# Altium project LineFollowRobot.PrjPcb
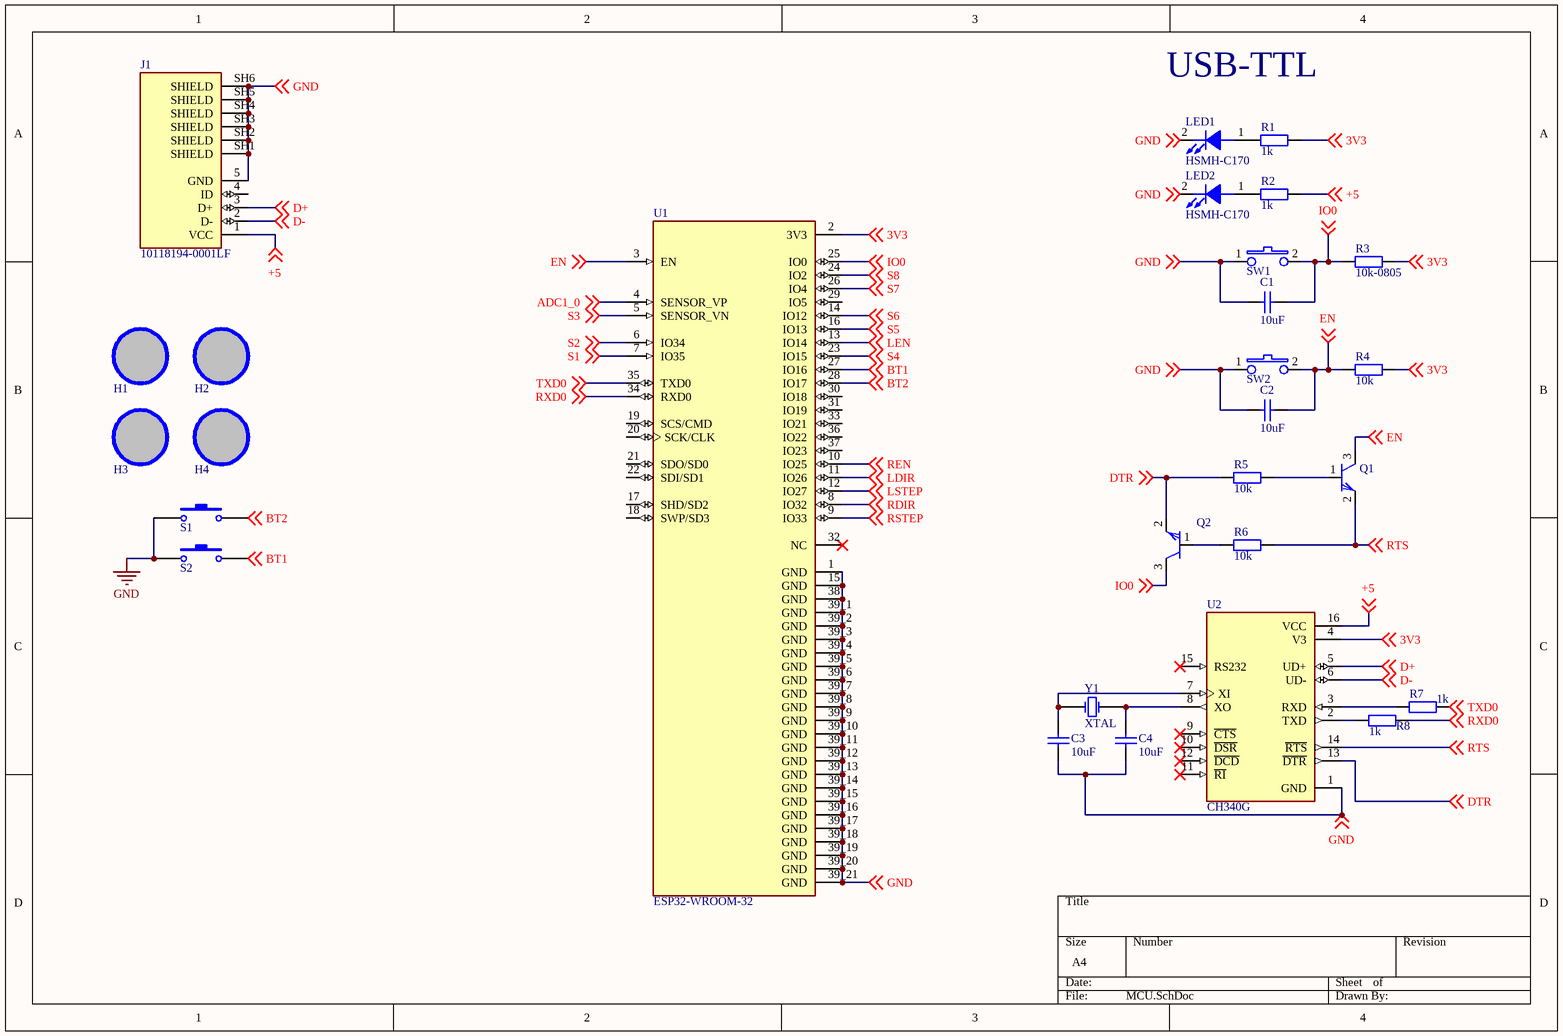
[diagram p0: MCU.SchDoc]
4 sheets, 66 parts. Net scope: global (net labels, ports and power ports of the same name join across sheets).
Board file: PCB1.PcbDoc
Sheets:
  MCU.SchDoc
  Stepper.SchDoc
  Sensor.SchDoc
  ECU supply.SchDoc

## Sheet MCU.SchDoc
size A4; SheetNumber: 1; SheetTotal: 4

### Parts
(Parts that share a designator on the sheet are numbered #1, #2 ... from top to bottom, then left to right.)
C1#1  value 10uF  [C-NP-0805]  (hidden comment: Cap Non-pol)
C2#1  value 10uF  [C-NP-0805]  (hidden comment: Cap Non-pol)
C3#1  value 10uF  [C-NP-0805]  (hidden comment: Cap Non-pol)
C4#1  value 10uF  [C-NP-0805]  (hidden comment: Cap Non-pol)
H1  Hole  [LO KHOAN 3MM]  (value not drawn)
H2  Hole  [LO KHOAN 3MM]  (value not drawn)
H3  Hole  [LO KHOAN 3MM]  (value not drawn)
H4  Hole  [LO KHOAN 3MM]  (value not drawn)
J1#1  10118194-0001LF  [AMPHENOL_10118194-0001LF]
LED1  HSMH-C170  [LED.SMD.RED]
LED2  HSMH-C170  [LED.SMD.RED]
Q1  C1815  [SOT23N]  (value not drawn)
Q2  C1815  [SOT23N]  (value not drawn)
R1#1  value 1k  [DIEN TRO 0805]  (hidden comment: RES_SMD_0805)
R2#1  value 1k  [DIEN TRO 0805]  (hidden comment: RES_SMD_0805)
R3#1  value 10k-0805  [DIEN TRO 0805]  (hidden comment: RES_SMD_0805)
R4#1  value 10k  [DIEN TRO 0805]  (hidden comment: RES_SMD_0805)
R5  value 10k  [DIEN TRO 0805]  (hidden comment: RES_SMD_0805)
R6  value 10k  [DIEN TRO 0805]  (hidden comment: RES_SMD_0805)
R7  value 1k  [DIEN TRO 0805]  (hidden comment: RES_SMD_0805)
R8  value 1k  [DIEN TRO 0805]  (hidden comment: RES_SMD_0805)
S1  Tact SW - 2Pin  [SW2]  (value not drawn)
S2  Tact SW - 2Pin  [SW2]  (value not drawn)
SW1  PTS635  [TactSwitches.PTS635.SMT]  (value not drawn)
SW2  PTS635  [TactSwitches.PTS635.SMT]  (value not drawn)
U1#1  ESP32-WROOM-32  [MODULE_ESP32-WROOM-32]
U2#1  CH340G  [SOIC127P600X180-16N]
Y1  XTAL  [XTAL]

### Nets
3V3: R1#1.2 R3#1.2 R4#1.2 U1#1.2(3V3) U2#1.4(V3) ; off-sheet 3V3
+5: J1#1.1(VCC) R2#1.2 U2#1.16(VCC) ; off-sheet +5
GND: C1#1.1 C2#1.1 C3#1.1 C4#1.1 J1#1.5(GND) J1#1.SH1(SHIELD) J1#1.SH2(SHIELD) J1#1.SH3(SHIELD) J1#1.SH4(SHIELD) J1#1.SH5(SHIELD) J1#1.SH6(SHIELD) LED1.2(K) LED2.2(K) S1.1 S2.1 SW1.1 SW2.1 U1#1.1(GND) U1#1.15(GND) U1#1.38(GND) U1#1.39_1(GND) U1#1.39_2(GND) U1#1.39_3(GND) U1#1.39_4(GND) U1#1.39_5(GND) U1#1.39_6(GND) U1#1.39_7(GND) U1#1.39_8(GND) U1#1.39_9(GND) U1#1.39_10(GND) U1#1.39_11(GND) U1#1.39_12(GND) U1#1.39_13(GND) U1#1.39_14(GND) U1#1.39_15(GND) U1#1.39_16(GND) U1#1.39_17(GND) U1#1.39_18(GND) U1#1.39_19(GND) U1#1.39_20(GND) U1#1.39_21(GND) U2#1.1(GND) ; off-sheet GND
ADC1_0: U1#1.4(SENSOR_VP) ; off-sheet ADC1_0
BT1: S2.2 U1#1.27(IO16) ; off-sheet BT1
BT2: S1.2 U1#1.28(IO17) ; off-sheet BT2
D+: J1#1.3(D+) U2#1.5(UD+) ; off-sheet D+
D-: J1#1.2(D-) U2#1.6(UD-) ; off-sheet D-
DTR: Q2.2(E) R5.1 U2#1.13(~{DTR}) ; off-sheet DTR
EN: C2#1.2 Q1.3(C) R4#1.1 SW2.2 U1#1.3(EN) ; off-sheet EN
IO0: C1#1.2 Q2.3(C) R3#1.1 SW1.2 U1#1.25(IO0) ; off-sheet IO0
LDIR: U1#1.11(IO26) ; off-sheet LDIR
LEN: U1#1.13(IO14) ; off-sheet LEN
LSTEP: U1#1.12(IO27) ; off-sheet LSTEP
RDIR: U1#1.8(IO32) ; off-sheet RDIR
REN: U1#1.10(IO25) ; off-sheet REN
RSTEP: U1#1.9(IO33) ; off-sheet RSTEP
RTS: Q1.2(E) R6.2 U2#1.14(~{RTS}) ; off-sheet RTS
RXD0: R8.2 U1#1.34(RXD0) ; off-sheet RXD0
S1: U1#1.7(IO35) ; off-sheet S1
S2: U1#1.6(IO34) ; off-sheet S2
S3: U1#1.5(SENSOR_VN) ; off-sheet S3
S4: U1#1.23(IO15) ; off-sheet S4
S5: U1#1.16(IO13) ; off-sheet S5
S6: U1#1.14(IO12) ; off-sheet S6
S7: U1#1.26(IO4) ; off-sheet S7
S8: U1#1.24(IO2) ; off-sheet S8
TXD0: R7.2 U1#1.35(TXD0) ; off-sheet TXD0
NetC3#1_2: C3#1.2 U2#1.7(XI) Y1.2(OSC2)
NetC4#1_2: C4#1.2 U2#1.8(XO) Y1.1(OSC1)
NetLED1_1: LED1.1(A) R1#1.1
NetLED2_1: LED2.1(A) R2#1.1
NetQ1_1: Q1.1(B) R5.2
NetQ2_1: Q2.1(B) R6.1
NetR7_1: R7.1 U2#1.3(RXD)
NetR8_1: R8.1 U2#1.2(TXD)

Not connected (* = marked no-connect by the designer): H1 1; H2 1; H3 1; H4 1; J1#1 4(ID); U1#1 17(SHD/SD2) 18(SWP/SD3) 19(SCS/CMD) 20(SCK/CLK) 21(SDO/SD0) 22(SDI/SD1) 29(IO5) 30(IO18) 31(IO19) 32(NC)* 33(IO21) 36(IO22) 37(IO23); U2#1 9(~{CTS})* 10(~{DSR})* 11(~{RI})* 12(~{DCD})* 15(RS232)*

### Notes on the sheet
- USB-TTL

### Library data of the parts
C1#1 C2#1 C3#1 C4#1 = Cap Non-pol: Non-polarized Capacitor; Published: 8-Jun-2000; LatestRevisionDate: 17-Jul-2002; LatestRevisionNote: Re-released for DXP Platform.; PackageReference: RAD-0.3; Publisher: Altium Limited
H1-H4 = Hole: Hole 3mm
J1#1 = 10118194-0001LF: Micro USB, Input Output Connectors, B TYPE RECEPTACLE with flange; MF: Amphenol ICC; SnapEDA_Link: https://www.snapeda.com/parts/10118194-0001LF/Amphenol+FCI/view-part/?ref=snap; Package: None; Value: *; MP: 10118194-0001LF; Check_prices: https://www.snapeda.com/parts/10118194-0001LF/Amphenol+FCI/view-part/?ref=eda
LED1 LED2 = LED_1: Typical GaAs SMD LED; Manufacturer: Lite-On Inc; Color: RED; Type: Cong ty RP; Vendor: Digikey; Publisher: Hoang Nguyen; Price: *; Published: 13-April-2009; ComponentLink1Description: Digikey Part Link; ComponentLink2Description: Open Datasheet; ComponentLink2URL: H:\LIBRARY\LIBRARY.Datasheet\
Q1 Q2 = C1815: Q2SC1815; PSpiceTemplate: Q^@REFDES %c %b %e @MODEL; Vendor: Digikey; COMPONENT: 2SC1815; Published: 13-April-2009; Publisher: Hoang Nguyen; ComponentLink1Description: Digikey Part Link; ComponentLink2Description: Open Datasheet; ComponentLink2URL: H:\LIBRARY\LIBRARY.Datasheet\; Price: 500VND
R1#1 R2#1 R3#1 R4#1 R5-R8 = RES_SMD_0805: RES_0805; Published: 8-Jun-2000; LatestRevisionDate: 17-Jul-2002; LatestRevisionNote: Re-released for DXP Platform.; PackageReference: AXIAL-0.4; Publisher: Altium Limited
S1 S2 = Tact SW - 2Pin: Switch button 2 pin
SW1 SW2 = SW TACT MOM SPST: SWITCH TACT MOM SPST SMD; Manufacturer: C&K Components; Manufacturer P/N: PTS635SL25SMTR LFS; Vendor: Digikey; Vendor P/N: CKN9119CT-ND; ComponentLink1URL: http://search.digikey.com/scripts/DkSearch/dksus.dll?Detail&name=CKN1573CT-ND; ComponentLink2URL: H:\LIBRARY\LIBRARY.Datasheet\SBLCDA4_Specification.pdf; ComponentLink1Description: Digikey Part Link; ComponentLink2Description: Open Datasheet; Publisher: Hoang Nguyen; Published: 13-April-2009
U1#1 = ESP32-WROOM-32: Bluetooth, WiFi 802.11b/g/n, Bluetooth v4.2 +EDR, Class 1, 2 and 3 Transceiver Module 2.4GHz ~ 2.5GHz Antenna Not Included, U.FL Surface Mount; MF: Espressif Systems; Price: None; Availability: In Stock; MP: ESP32-WROOM-32; Package: Module Espressif Systems; SnapEDA_Link: https://www.snapeda.com/parts/ESP32-WROOM-32/Espressif+Systems/view-part/?ref=snap; Check_prices: https://www.snapeda.com/parts/ESP32-WROOM-32/Espressif+Systems/view-part/?ref=eda; Value: *; Purchase-URL: https://pricing.snapeda.com/search/part/ESP32-WROOM-32/?ref=eda
U2#1 = CH340G: USB Interface Integrated Circuit; MF: WCH; Value: *; SnapEDA_Link: https://www.snapeda.com/parts/Ch340G/WCH/view-part/?ref=snap; MP: Ch340G; Check_prices: https://www.snapeda.com/parts/Ch340G/WCH/view-part/?ref=eda; Availability: Not in stock; Price: None; Package: None
Y1 = XTAL: Crystal Oscillator; Published: 8-Jun-2000; LatestRevisionDate: 17-Jul-2002; LatestRevisionNote: Re-released for DXP Platform.; PackageReference: R38; Publisher: Altium Limited

## Sheet Stepper.SchDoc
size A; SheetNumber: 2; SheetTotal: 4
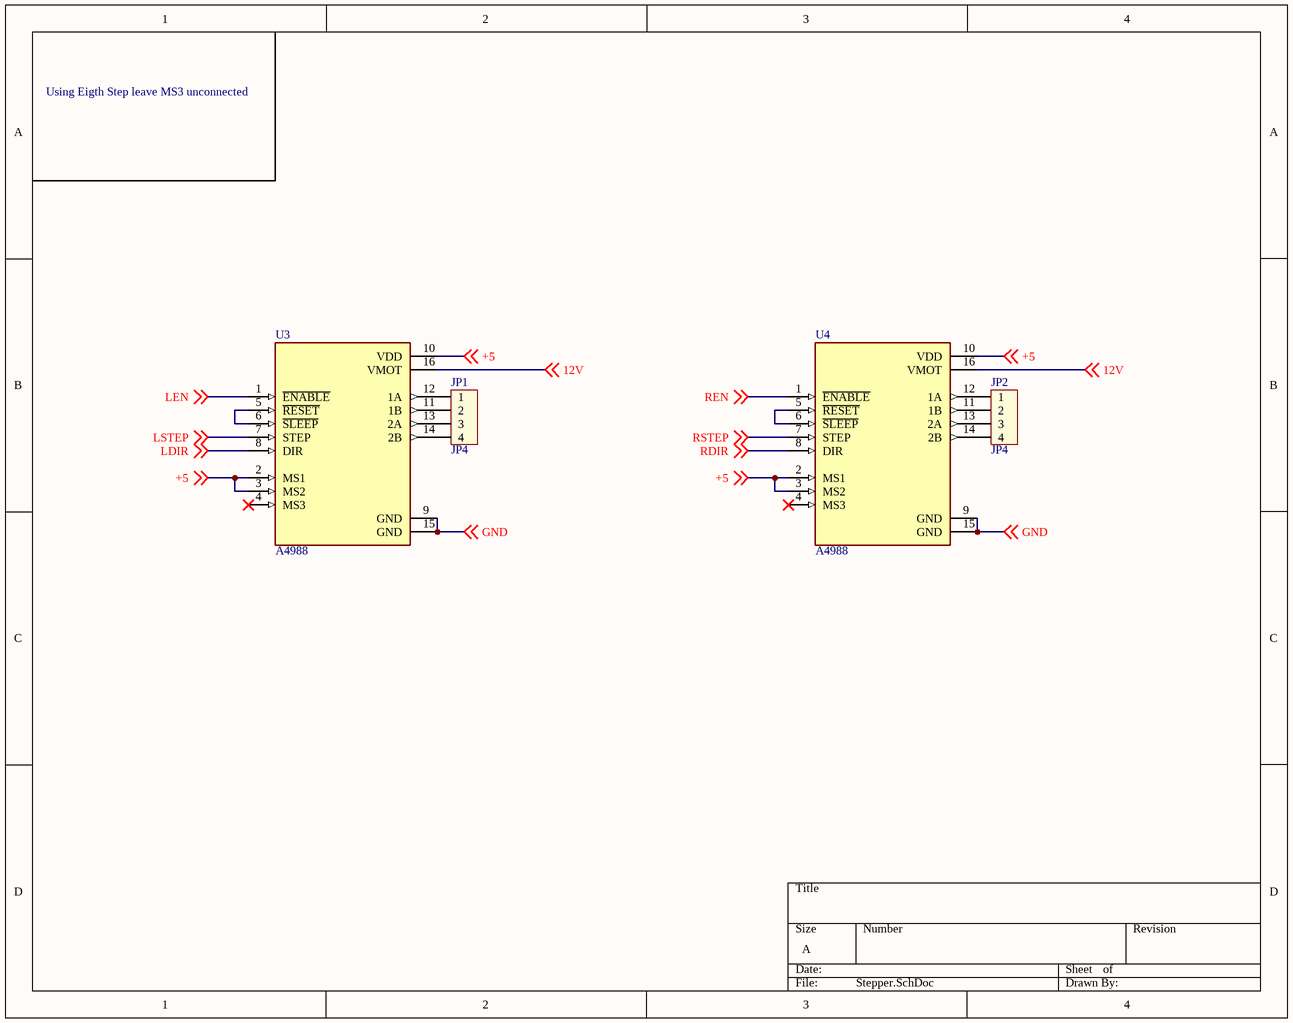
[diagram p1: Stepper.SchDoc]

### Parts
JP1  JP4  [CON4]
JP2  JP4  [CON4]
U3  A4988  [MODULE_A4988_STEPPER_MOTOR_DRIVER_CARRIER]
U4  A4988  [MODULE_A4988_STEPPER_MOTOR_DRIVER_CARRIER]

### Nets
+5: U3.2(MS1) U3.3(MS2) U3.10(VDD) U4.2(MS1) U4.3(MS2) U4.10(VDD) ; off-sheet +5
GND: U3.9(GND) U3.15(GND) U4.9(GND) U4.15(GND) ; off-sheet GND
12V: U3.16(VMOT) U4.16(VMOT) ; off-sheet 12V
LDIR: U3.8(DIR) ; off-sheet LDIR
LEN: U3.1(~{ENABLE}) ; off-sheet LEN
LSTEP: U3.7(STEP) ; off-sheet LSTEP
RDIR: U4.8(DIR) ; off-sheet RDIR
REN: U4.1(~{ENABLE}) ; off-sheet REN
RSTEP: U4.7(STEP) ; off-sheet RSTEP
NetJP1_1: JP1.1 U3.12(1A)
NetJP1_2: JP1.2 U3.11(1B)
NetJP1_3: JP1.3 U3.13(2A)
NetJP1_4: JP1.4 U3.14(2B)
NetJP2_1: JP2.1 U4.12(1A)
NetJP2_2: JP2.2 U4.11(1B)
NetJP2_3: JP2.3 U4.13(2A)
NetJP2_4: JP2.4 U4.14(2B)
NetU3_5: U3.5(~{RESET}) U3.6(~{SLEEP})
NetU4_5: U4.5(~{RESET}) U4.6(~{SLEEP})

Not connected (* = marked no-connect by the designer): U3 4(MS3)*; U4 4(MS3)*

### Notes on the sheet
- Using Eigth Step leave MS3 unconnected

### Library data of the parts
JP1 JP2 = Con4: Connector 4; Value: Connector 4
U3 U4 = A4988_STEPPER_MOTOR_DRIVER_CARRIER: Stepper motor controler; IC: A4988; 1A; Uin mot: 8Ã·35V; Price: None; Value: *; MP: A4988_STEPPER_MOTOR_DRIVER_CARRIER; Package: None; Availability: Unavailable

## Sheet Sensor.SchDoc
size A4; SheetNumber: 1; SheetTotal: 2
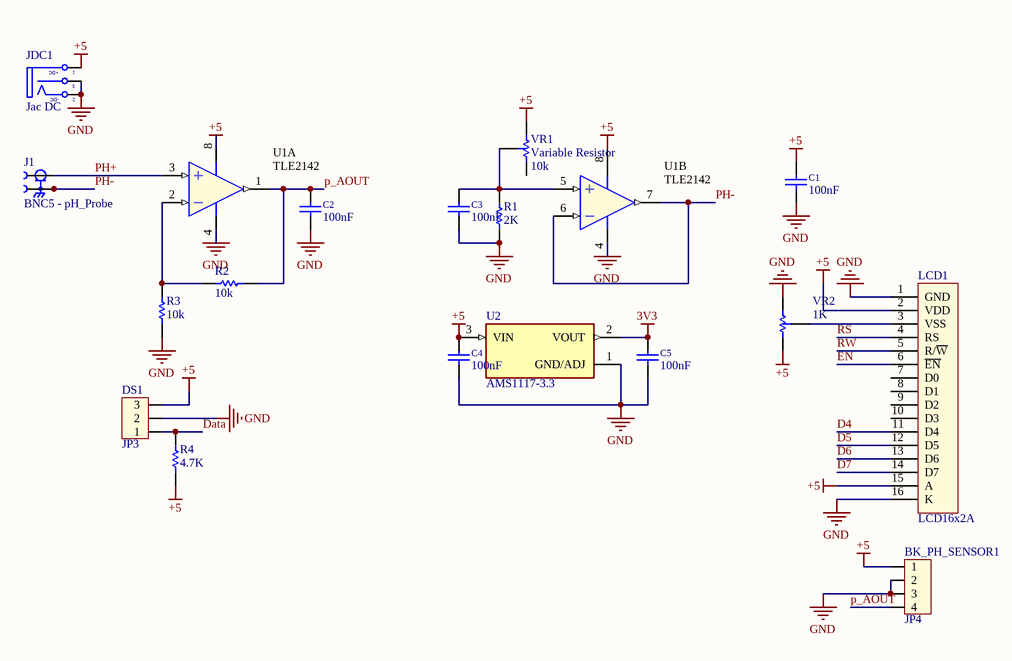
[diagram p2: Sensor.SchDoc]

### Parts
(Parts that share a designator on the sheet are numbered #1, #2 ... from top to bottom, then left to right.)
BK_PH_SENSOR1  JP4  [CON4]
C1#2  100nF  [C2012-0805]
C2#2  100nF  [C2012-0805]
C3#2  100nF  [C2012-0805]
C4#2  100nF  [C2012-0805]
C5#1  100nF  [C2012-0805]
DS1  JP3  [CON3]
J1#2  BNC5 - pH_Probe  [SAMTEC_BNC5-J-P-GN-RA-BH2D]
JDC1  Jac DC  [DC-IN]
LCD1  LCD16x2A  [LCD16X2]
R1#2  value 2K  [R-0805]  (hidden comment: RESISTOR)
R2#2  value 10k  [R-0805]  (hidden comment: RESISTOR)
R3#2  value 10k  [R-0805]  (hidden comment: RESISTOR)
R4#2  value 4.7K  [R-0805]  (hidden comment: RESISTOR)
U1#2  TLE2142  [SOIC8]  (parts A,B of 2)
U2#2  AMS1117-3.3  [SOT229P700X180-4N]
VR1  Variable Resistor  value 10k  [VRes-R]
VR2  value 1K  [VRes-C]

### Nets
3V3: C5#1.2 U2#2.2(VOUT)
+5: BK_PH_SENSOR1.1 C1#2.2 C4#2.2 DS1.3 JDC1.1(T) LCD1.2(VDD) LCD1.15(A) R4#2.1 U1#2.8(V+) U2#2.3(VIN) VR1.1 VR2.1
GND: BK_PH_SENSOR1.2 BK_PH_SENSOR1.3 C1#2.1 C2#2.1 C3#2.1 C4#2.1 C5#1.1 DS1.2 JDC1.2(TN) JDC1.3(S) LCD1.1(GND) LCD1.16(K) R1#2.1 R3#2.1 U1#2.4(GND) U2#2.1(GND/ADJ) VR2.3
D4: LCD1.11(D4)
D5: LCD1.12(D5)
D6: LCD1.13(D6)
D7: LCD1.14(D7)
Data: DS1.1 R4#2.2
EN: LCD1.6(~{EN})
p_AOUT: BK_PH_SENSOR1.4 C2#2.2 R2#2.2 U1#2.1(OUT)
PH+: J1#2.1 U1#2.3(IN+)
PH-: J1#2.S_1 J1#2.S_2 J1#2.S_3 J1#2.S_4 U1#2.6(IN-) U1#2.7(OUT)
RS: LCD1.4(RS)
RW: LCD1.5(R/~{W})
NetC3#2_2: C3#2.2 R1#2.2 U1#2.5(IN+) VR1.2
NetLCD1_3: LCD1.3(VSS) VR2.2
NetR2#2_1: R2#2.1 R3#2.2 U1#2.2(IN-)

Not connected (* = marked no-connect by the designer): LCD1 7(D0) 8(D1) 9(D2) 10(D3); VR1 3

### Notes on the sheet
- (in symbol DCIN) +DC; -DC

### Library data of the parts
BK_PH_SENSOR1 = Con4: Connector 4; Value: Connector 4
C1#2 C2#2 C3#2 C4#2 C5#1 = Capacitor: AEMS Code: 2100341; Vendor: Digikey; Volt: 16V; Published: 13-April-2009; Publisher: Hoang Nguyen; ComponentLink1Description: Digikey Part Link; ComponentLink2Description: Open Datasheet; ComponentLink2URL: H:\LIBRARY\LIBRARY.Datasheet\; Value: 100nF
DS1 = Con3: Connector 3; Value: Connector 3
J1#2 = BNC5-J-P-GN-RA-BH2D: BNC Connector Jack, Female Socket 50Ohm Panel Mount, Through Hole, Right Angle Solder; MF: Samtec; Value: *; SnapEDA_Link: https://www.snapeda.com/parts/BNC5-J-P-GN-RA-BH2D/Samtec%20Inc./view-part/933377/?ref=snap; MP: BNC5-J-P-GN-RA-BH2D; Check_prices: https://www.snapeda.com/parts/BNC5-J-P-GN-RA-BH2D/Samtec%20Inc./view-part/933377/?ref=eda; Purchase-URL: https://pricing.snapeda.com/search/part/BNC5-J-P-GN-RA-BH2D/?ref=eda; Availability: In Stock; Price: None; Package: None
JDC1 = DCIN: Jac DC input; Value: Jac DC
LCD1 = LCD16x2: LCD dipslay 16 char, 2 line; Value: LCD16x2A
U1#2 = LM2904: Low-Power Dual Operational Amplifier; Published: 15-Apr-2002; LatestRevisionDate: 06-Jun-2005; LatestRevisionNote: Stylized 3D Model Added.; DatasheetVersion: Sep-1999; PackageVersion: Sep-1997; PackageReference: N08E; Publisher: Altium Limited; PackageDescription: DIP; 8 Leads; Row Spacing 7.62 mm; Pitch 2.54 mm; ComponentLink1Description: Manufacturer Link; ComponentLink1URL: http://www.national.com/; ComponentLink2Description: Datasheet; ComponentLink2URL: http://www.national.com/ds.cgi/LM/LM158.pdf; ComponentLink3Description: URL Link1; ComponentLink3URL: http://www.national.com/pf/LM/LM358.html
U2#2 = AMS1117-3.3: Sot223/Pkg 1-Amp 3.3-Volt Low Drop Out Voltage Regulatator; MF: Advanced Monolithic Systems; Package: SOT-223 Seeed Technology; Value: *; Check_prices: https://www.snapeda.com/parts/AMS1117-3.3/Advanced+Monolithic+Systems/view-part/?ref=eda; Price: None; Availability: Not in stock; MP: AMS1117-3.3; SnapEDA_Link: https://www.snapeda.com/parts/AMS1117-3.3/Advanced+Monolithic+Systems/view-part/?ref=snap
VR2 = Variable Resistor: Published: 8-Jun-2000; LatestRevisionDate: 17-Jul-2002; LatestRevisionNote: Re-released for DXP Platform.; PackageReference: AXIAL-0.3; Publisher: Altium Limited
R1#2 R2#2 R3#2 R4#2 = RESISTOR: Published: 8-Jun-2000; LatestRevisionDate: 17-Jul-2002; LatestRevisionNote: Re-released for DXP Platform.; PackageReference: AXIAL-0.3; Publisher: Altium Limited
VR1 = Variable Resistor: Published: 8-Jun-2000; LatestRevisionDate: 17-Jul-2002; LatestRevisionNote: Re-released for DXP Platform.; PackageReference: AXIAL-0.3; Publisher: Altium Limited

## Sheet ECU supply.SchDoc
size A; SheetNumber: 4; SheetTotal: 4
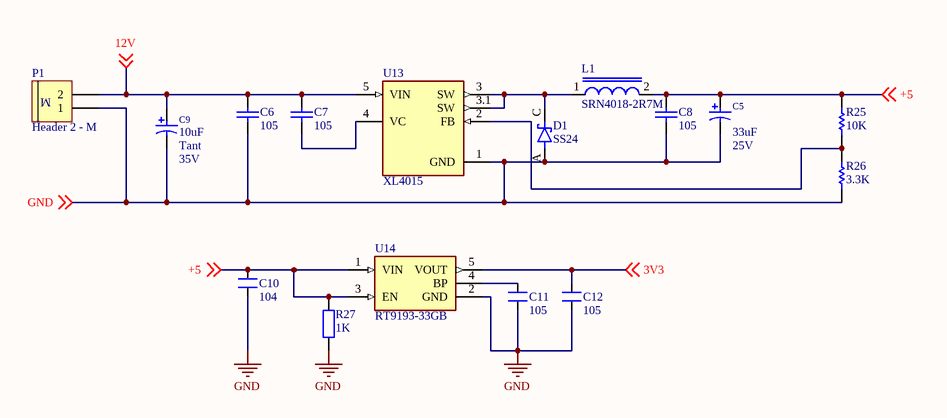
[diagram p3: ECU supply.SchDoc]

### Parts
(Parts that share a designator on the sheet are numbered #1, #2 ... from top to bottom, then left to right.)
C5#2  Capacitor Type: 33uF  Volt: 25V  [Cap_smd_4_3MM]
C6  value 105  [C-NP-0805]  (hidden comment: Cap Non-pol)
C7  value 105  [C-NP-0805]  (hidden comment: Cap Non-pol)
C8  value 105  [C-NP-0805]  (hidden comment: Cap Non-pol)
C9  Capacitor Type: Tant  Volt: 35V  [Cap_smd_4_3MM]  (hidden comment: 10uF)
C10  104  [SM-0805]
C11  105  [SM-0805]
C12  105  [SM-0805]
D1  SS24  [DIOM5336X265N]
L1  SRN4018-2R7M  [INDP4040X180N]
P1  Header 2 - M  [Medium - Header 2]
R25  value 10K  [R-0805]  (hidden comment: RESISTOR)
R26  value 3.3K  [R-0805]  (hidden comment: RESISTOR)
R27  1K  [SM-0805]
U13  XL4015  [CONV_XL4015]
U14  RT9193-33GB  [SOT94P279X129-5N]

### Nets
3V3: C12.2 U14.5(VOUT) ; off-sheet 3V3
+5: C5#2.1 C8.2 C10.2 L1.2 R25.2 R27.1 U14.1(VIN) U14.3(EN) ; off-sheet +5
GND: C5#2.2 C6.1 C8.1 C9.2 C10.1 C11.1 C12.1 D1.A P1.1 R26.1 R27.2 U13.1(GND) U14.2(GND) ; off-sheet GND
12V: C6.2 C7.2 C9.1 P1.2 U13.5(VIN) ; off-sheet 12V
NetC7_1: C7.1 U13.4(VC)
NetC11_2: C11.2 U14.4(BP)
NetD1_C: D1.C(K) L1.1 U13.3(SW) U13.3.1(SW)
NetR25_1: R25.1 R26.2 U13.2(FB)

### Notes on the sheet
- (in symbol Header 2 - M) M

### Library data of the parts
C5#2 C9 = Cap_Pol: Polarized Capacitor; Manufacturer: FARNELL; AEMS Code: 2100110; Vendor: Digikey; Published: 13-April-2009; Publisher: Hoang Nguyen; ComponentLink1Description: Digikey Part Link; ComponentLink2Description: Open Datasheet; ComponentLink2URL: H:\LIBRARY\LIBRARY.Datasheet\
  C9: Value: 10uF
C6-C8 = Cap Non-pol: Non-polarized Capacitor; Published: 8-Jun-2000; LatestRevisionDate: 17-Jul-2002; LatestRevisionNote: Re-released for DXP Platform.; PackageReference: RAD-0.3; Publisher: Altium Limited
C10-C12 = CM: Cap SMD; Value: 103
D1 = SS24: Diode Schottky 40V 2A Surface Mount DO-214AA (SMB); MF: ON Semiconductor; Package: DO-214AA ON Semiconductor; Price: None; Value: *; SnapEDA_Link: https://www.snapeda.com/parts/SS24/Onsemi/view-part/?ref=snap; MP: SS24; Availability: In Stock; Check_prices: https://www.snapeda.com/parts/SS24/Onsemi/view-part/?ref=eda
L1 = SRN4018-2R7M: 2.7ÂµH Semi-Shielded Wirewound Inductor 2.3A 52mOhm Max Nonstandard; MF: Bourns; Package: Nonstandard Bourns; Purchase-URL: https://pricing.snapeda.com/search/part/SRN4018-2R7M/?ref=eda; MP: SRN4018-2R7M; Price: None; Value: *; Availability: Good; SnapEDA_Link: https://www.snapeda.com/parts/SRN4018-2R7M/Bourns/view-part/46408/?ref=snap; Check_prices: https://www.snapeda.com/parts/SRN4018-2R7M/Bourns/view-part/46408/?ref=eda
P1 = Header 2 - M: Header, 2-Pin, Medium; LatestRevisionDate: 17-Jul-2002; LatestRevisionNote: Re-released for DXP Platform.; Publisher: Altium Limited
R27 = RM: Resistor SMD; Value: 1K
U13 = XL4015: 5A 180KHz 36V Buck DC to DC Converter; Price: None; MP: XL4015; Value: *; Availability: Unavailable; Package: None
U14 = RT9193-33GB: Linear Voltage Regulator IC Positive Fixed 1 Output 300mA TSOT-23-5; MF: Richtek USA; SnapEDA_Link: https://www.snapeda.com/parts/RT9193-33GB/Richtek+USA+Inc./view-part/?ref=snap; Package: SOT-23-5 Richtek; MP: RT9193-33GB; Check_prices: https://www.snapeda.com/parts/RT9193-33GB/Richtek+USA+Inc./view-part/?ref=eda; Purchase-URL: https://pricing.snapeda.com/search/part/RT9193-33GB/?ref=eda; Digi-Key_Part_Number: 1028-1014-2-ND; Value: *
R25 R26 = RESISTOR: Published: 8-Jun-2000; LatestRevisionDate: 17-Jul-2002; LatestRevisionNote: Re-released for DXP Platform.; PackageReference: AXIAL-0.3; Publisher: Altium Limited

## Nets that join several sheets
3V3: MCU (5 pins), Sensor (C5#1.2 U2#2.2), ECU supply (C12.2 U14.5)
+5: MCU (J1#1.1 R2#1.2 U2#1.16), Stepper (6 pins), Sensor (12 pins), ECU supply (8 pins)
GND: MCU (42 pins), Stepper (U3.9 U3.15 U4.9 U4.15), Sensor (17 pins), ECU supply (13 pins)
12V: Stepper (U3.16 U4.16), ECU supply (5 pins)
EN: MCU (5 pins), Sensor (LCD1.6)
LDIR: MCU (U1#1.11), Stepper (U3.8)
LEN: MCU (U1#1.13), Stepper (U3.1)
LSTEP: MCU (U1#1.12), Stepper (U3.7)
RDIR: MCU (U1#1.8), Stepper (U4.8)
REN: MCU (U1#1.10), Stepper (U4.1)
RSTEP: MCU (U1#1.9), Stepper (U4.7)